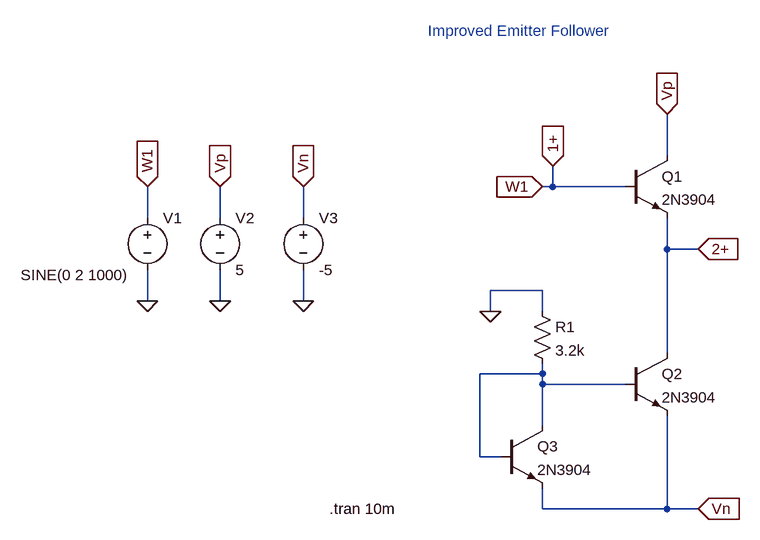
[diagram p0: schematic imp_emit_flw_ltspice.asc]
imp_emit_flw_ltspice.asc, the LTspice schematic file:
Version 4
SHEET 1 880 680
WIRE 544 -160 544 -224
WIRE 368 -112 368 -144
WIRE 368 -112 352 -112
WIRE 480 -112 368 -112
WIRE -256 -64 -256 -112
WIRE -144 -64 -144 -112
WIRE -16 -64 -16 -112
WIRE 544 -16 544 -64
WIRE 592 -16 544 -16
WIRE 352 48 272 48
WIRE -256 64 -256 16
WIRE -144 64 -144 16
WIRE -16 64 -16 16
WIRE 272 80 272 48
WIRE 352 80 352 48
WIRE 544 144 544 -16
WIRE 352 176 352 160
WIRE 352 176 256 176
WIRE 352 192 352 176
WIRE 480 192 352 192
WIRE 352 256 352 192
WIRE 256 304 256 176
WIRE 288 304 256 304
WIRE 352 384 352 352
WIRE 544 384 544 240
WIRE 544 384 352 384
WIRE 592 384 544 384
FLAG 352 -112 W1
IOPIN 352 -112 In
FLAG 544 -224 Vp
IOPIN 544 -224 In
FLAG -256 64 0
FLAG -144 64 0
FLAG -16 64 0
FLAG -256 -112 W1
IOPIN -256 -112 In
FLAG -144 -112 Vp
IOPIN -144 -112 In
FLAG -16 -112 Vn
IOPIN -16 -112 In
FLAG 272 80 0
FLAG 592 384 Vn
IOPIN 592 384 In
FLAG 368 -144 1+
IOPIN 368 -144 In
FLAG 592 -16 2+
IOPIN 592 -16 In
SYMBOL npn 480 -160 R0
SYMATTR InstName Q1
SYMATTR Value 2N3904
SYMBOL voltage -256 -80 R0
WINDOW 3 -195 104 Left 2
WINDOW 123 0 0 Left 0
WINDOW 39 0 0 Left 0
SYMATTR Value SINE(0 2 1000)
SYMATTR InstName V1
SYMBOL voltage -144 -80 R0
WINDOW 123 0 0 Left 0
WINDOW 39 0 0 Left 0
SYMATTR InstName V2
SYMATTR Value 5
SYMBOL voltage -16 -80 R0
WINDOW 123 0 0 Left 0
WINDOW 39 0 0 Left 0
SYMATTR InstName V3
SYMATTR Value -5
SYMBOL npn 480 144 R0
SYMATTR InstName Q2
SYMATTR Value 2N3904
SYMBOL npn 288 256 R0
SYMATTR InstName Q3
SYMATTR Value 2N3904
SYMBOL res 336 64 R0
SYMATTR InstName R1
SYMATTR Value 3.2k
TEXT 24 384 Left 2 !.tran 10m
TEXT 176 -352 Left 2 ;Improved Emitter Follower

The netlist it stands for:
* imp_emit_flw_ltspice.asc
Q1 Vp 1+ 2+ 0 2N3904
V1 1+ 0 SINE(0 2 1000)
V2 Vp 0 5
V3 Vn 0 -5
Q2 2+ N001 Vn 0 2N3904
Q3 N001 N001 Vn 0 2N3904
R1 0 N001 3.2k
.model NPN NPN
.model PNP PNP
.lib standard.bjt
.tran 10m
* Improved Emitter Follower
.backanno
.end